# Altium schematic sheet Sheet2.SchDoc
size A4
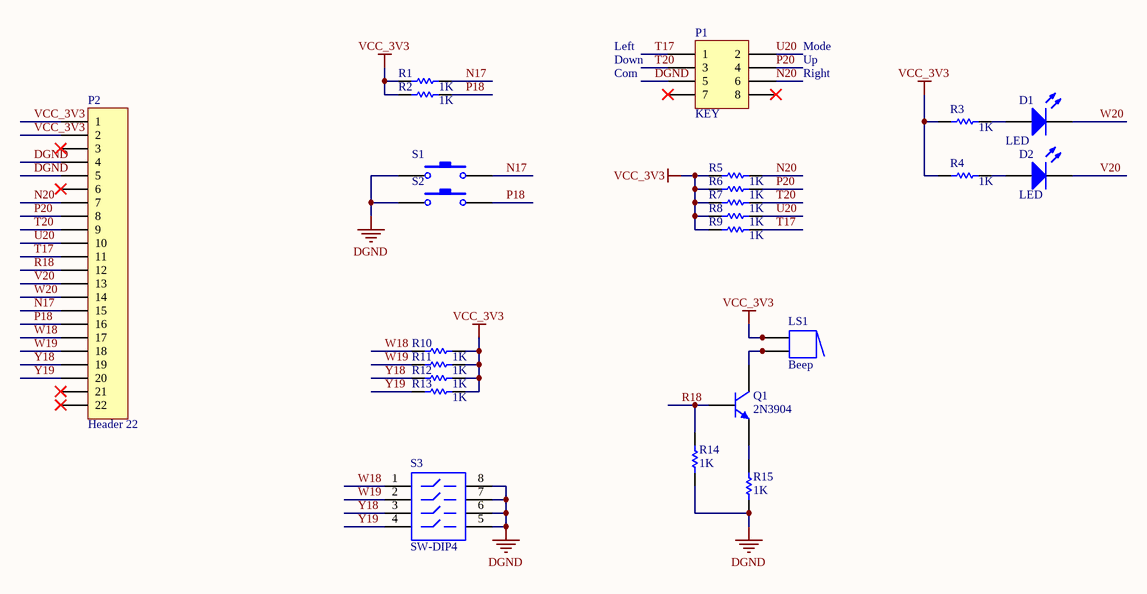
[diagram p0: Sheet2.SchDoc]

## Parts
D1  LED  [LED0805绿]
D2  LED  [LED0805绿]
LS1  Beep  [蜂鸣器]
P1  KEY  [贴片5向按键]
P2  Header 22  [FPC20Pin]
Q1  2N3904  [SOT23]
R1  value 1K  [R0805]  (hidden comment: Res1)
R2  value 1K  [R0805]  (hidden comment: Res1)
R3  value 1K  [R0805]  (hidden comment: Res1)
R4  value 1K  [R0805]  (hidden comment: Res1)
R5  value 1K  [R0805]  (hidden comment: Res1)
R6  value 1K  [R0805]  (hidden comment: Res1)
R7  value 1K  [R0805]  (hidden comment: Res1)
R8  value 1K  [R0805]  (hidden comment: Res1)
R9  value 1K  [R0805]  (hidden comment: Res1)
R10  value 1K  [R0805]  (hidden comment: Res1)
R11  value 1K  [R0805]  (hidden comment: Res1)
R12  value 1K  [R0805]  (hidden comment: Res1)
R13  value 1K  [R0805]  (hidden comment: Res1)
R14  value 1K  [R0805]  (hidden comment: Res1)
R15  value 1K  [R0805]  (hidden comment: Res1)
S1  SW-PB  [贴片按键]  (value not drawn)
S2  SW-PB  [贴片按键]  (value not drawn)
S3  SW-DIP4  [拨码开关4]

## Nets
DGND: P1.5 P2.4 P2.5 R14.1 R15.1 S1.1 S2.1 S3.5 S3.6 S3.7 S3.8
VCC_3V3: LS1.1 LS1.1A P2.1 P2.2 R1.1 R2.1 R3.1 R4.1 R5.1 R6.1 R7.1 R8.1 R9.1 R10.2 R11.2 R12.2 R13.2
N17: P2.15 R1.2 S1.2
N20: P1.6 P2.7 R5.2
P18: P2.16 R2.2 S2.2
P20: P1.4 P2.8 R6.2
R18: P2.12 Q1.B R14.2
T17: P1.1 P2.11 R9.2
T20: P1.3 P2.9 R7.2
U20: P1.2 P2.10 R8.2
V20: D2.2(K) P2.13
W18: P2.17 R10.1 S3.1
W19: P2.18 R11.1 S3.2
W20: D1.2(K) P2.14
Y18: P2.19 R12.1 S3.3
Y19: P2.20 R13.1 S3.4
NetD1_1: D1.1(A) R3.2
NetD2_1: D2.1(A) R4.2
NetLS1_2: LS1.2 Q1.C
NetQ1_E: Q1.E R15.2

Not connected (* = marked no-connect by the designer): P1 7* 8*; P2 3* 6* 21* 22*

## Notes on the sheet
- Left
- Down
- Com
- Mode
- Up
- Right

## Library data of the parts
D1 D2 = LED0: Typical INFRARED GaAs LED; Published: 8-Jun-2000; LatestRevisionDate: 08-Jul-2005; LatestRevisionNote: Mech Layer 1 removed.; PackageReference: LED-0; Publisher: Altium Limited; PackageDescription: LED; 2 Leads
LS1 = Buzzer: Magnetic Transducer Buzzer; Published: 24-Mar-1999; LatestRevisionDate: 17-Dec-2003; LatestRevisionNote: Schematic revised, PCB Footprint replaced.; DatasheetVersion: 17-Dec-2003; PackageReference: ABSM-1574; Publisher: Altium Limited; PackageDescription: Magnetic Transducer Buzzer; ComponentLink1Description: Manufacturer Link; ComponentLink1URL: http://www.megastar.com/linecard/buzzmode/index.php
P1 = Header 4X2: Header, 4-Pin, Dual row; LatestRevisionDate: 17-Jul-2002; LatestRevisionNote: Re-released for DXP Platform.; Publisher: Altium Limited
P2 = Header 22: Header, 22-Pin; LatestRevisionDate: 17-Jul-2002; LatestRevisionNote: Re-released for DXP Platform.; Publisher: Altium Limited
Q1 = 2N3904: NPN General Purpose Amplifier; Published: 8-Jun-2000; LatestRevisionDate: 15-Jan-2003; LatestRevisionNote: PCB Footprint 'BCY-W3/D4.7' replaced; DatasheetVersion: 1997; PackageVersion: Sep-1998; PackageReference: TO-92A; Publisher: Altium Limited; PackageDescription: TO, Flat Index; 3 In-Line, Axial Leads; Body Dia. 4.5mm; Leads 0.51 x 0.48 mm (max); ComponentLink1Description: Manufacturer Link; ComponentLink1URL: http://www.fairchildsemi.com/; ComponentLink2Description: Datasheet; ComponentLink2URL: http://www.fairchildsemi.com/ds/2N%2F2N3904.pdf
R1-R15 = Res1: Resistor; Published: 8-Jun-2000; LatestRevisionDate: 17-Jul-2002; LatestRevisionNote: Re-released for DXP Platform.; PackageReference: AXIAL-0.3; Publisher: Altium Limited; PackageDescription: Axial Device, Thru-Hole; 2 Leads; 0.3 in Pin Spacing
S1 S2 = SW-PB: Switch; Published: 24-Mar-1999; LatestRevisionDate: 17-Jul-2002; LatestRevisionNote: Re-released for DXP Platform.; PackageReference: SPST-2; Publisher: Altium Limited; PackageDescription: Switch; 2 Leads
S3 = SW-DIP4: DIP Switch; Published: 24-Mar-1999; LatestRevisionDate: 17-Jul-2002; LatestRevisionNote: Re-released for DXP Platform.; PackageReference: DIP-8; Publisher: Altium Limited